# EAGLE design DC24-Darknet_Badge-base (EAGLE 7.5.0)
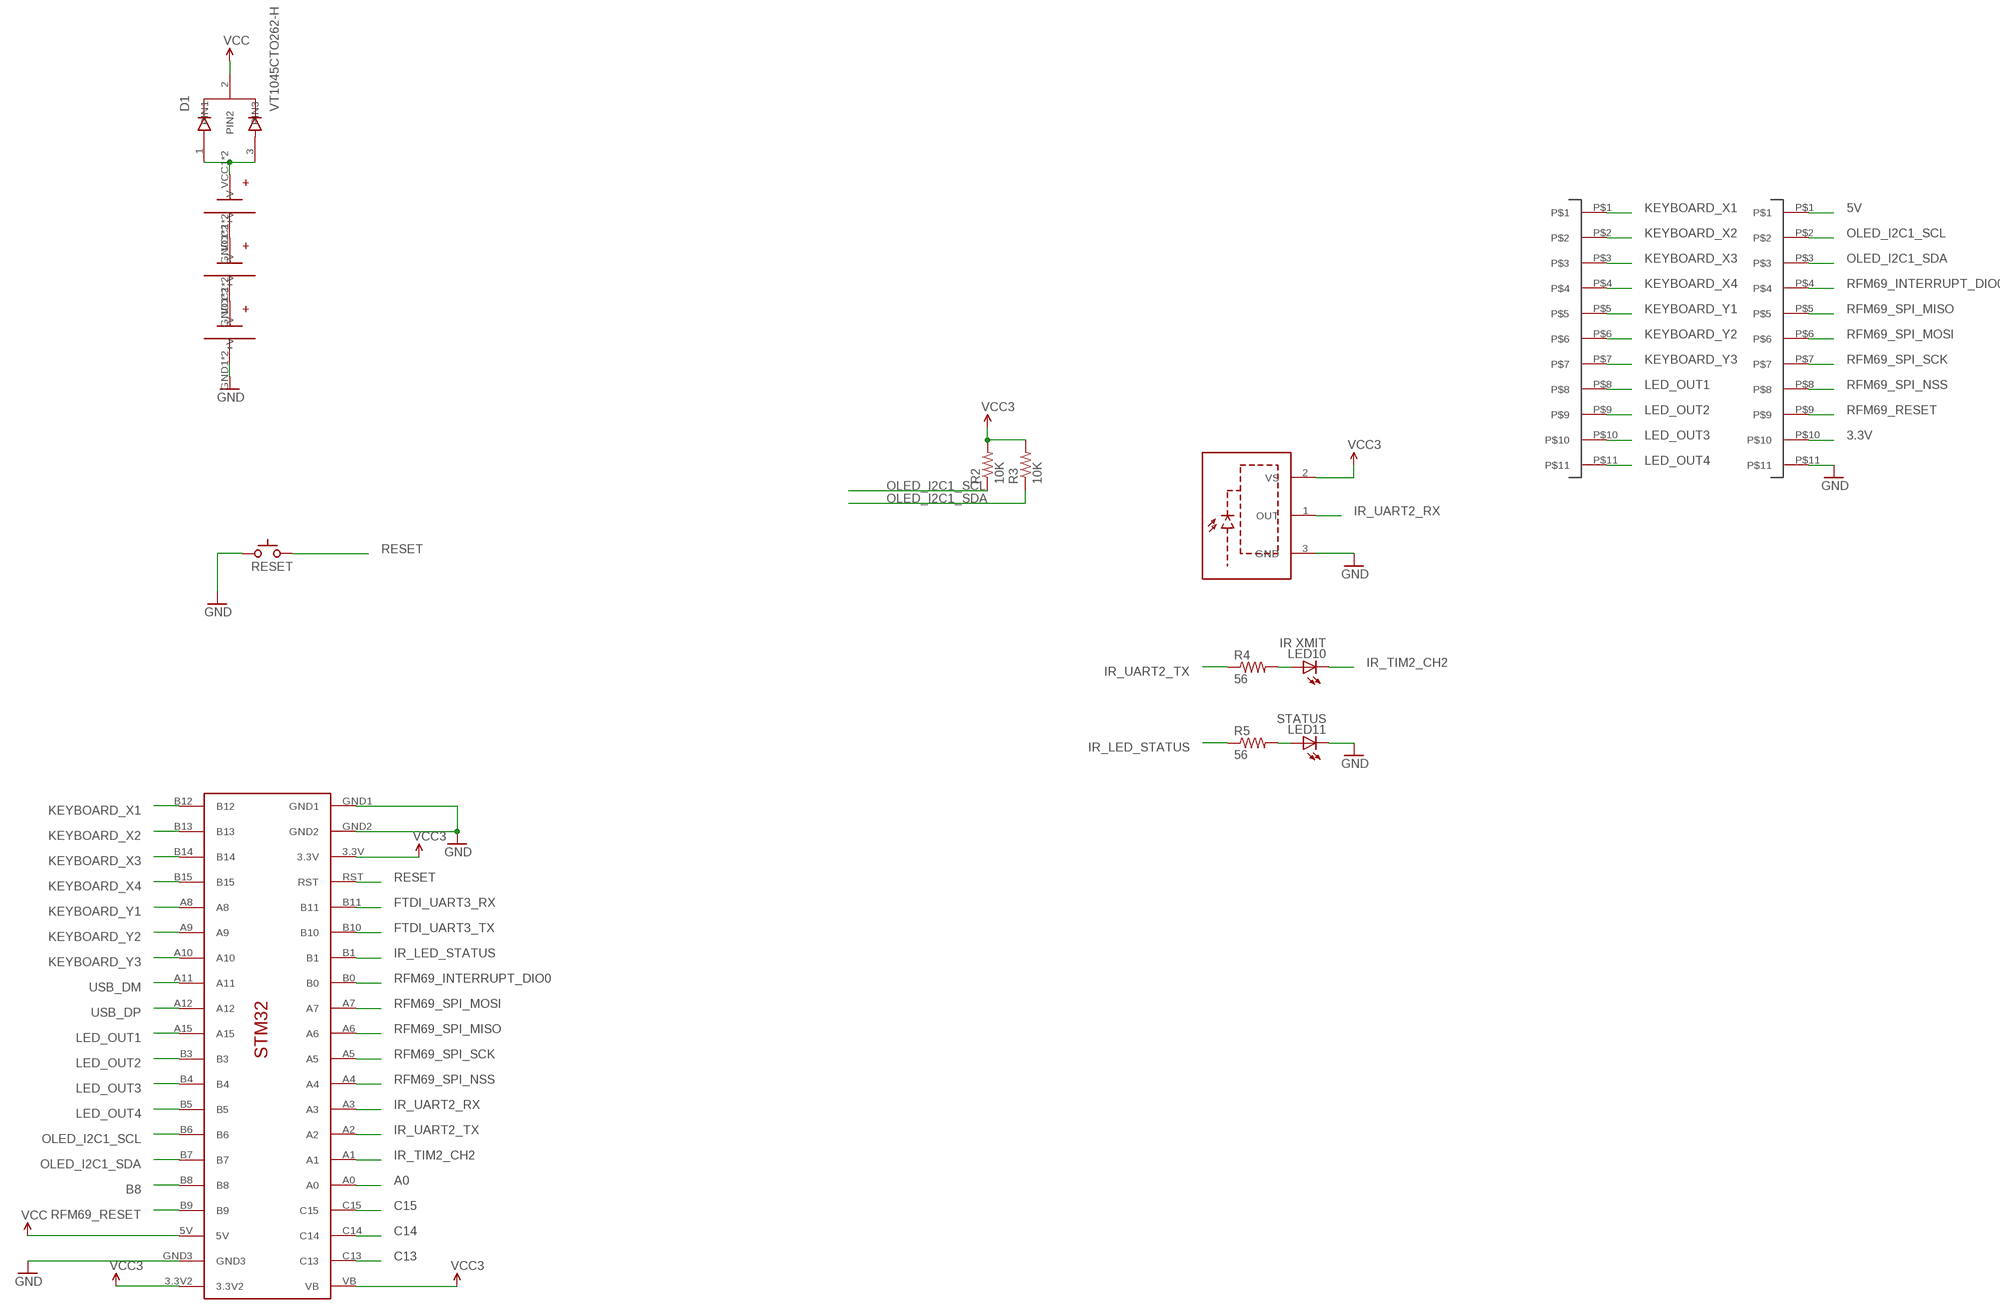
[diagram p0: schematic, sheet 1]

## Parts
D1  VT1045CTO262-H  [TO262-H]
LED10  IR XMIT  LEDLED5MM_EDGE  [LED5MM-EDGE]
LED11  STATUS  LEDLED5MM_EDGE  [LED5MM-EDGE]
R2  10K  RESISTORAXIAL-0.3  [AXIAL-0.3]
R3  10K  RESISTORAXIAL-0.3  [AXIAL-0.3]
R4  56  RESISTORAXIAL-0.3  [AXIAL-0.3]
R5  56  RESISTORAXIAL-0.3  [AXIAL-0.3]
RESET  SWITCH_TACTILETACTILE-2PIN-NARROW  [TACTILE-2PIN-NARROW]
U1  SOP22  [IR-MODULE]
U$3  AAA_BATTERYAAA_BATTERY_CLIP  [AAA_BATTERY_CLIP]
U$4  AAA_BATTERYAAA_BATTERY_CLIP  [AAA_BATTERY_CLIP]
U$5  AAA_BATTERYAAA_BATTERY_CLIP  [AAA_BATTERY_CLIP]
U$14  HEADER_11PIN  [1X11]
U$15  STM32_DEV_BOARDSTM32_DEV_BOARD  [STM32_DEV_BOARD]
U$17  HEADER_11PIN  [1X11]

## Nets
3.3V: R2.P$2 R3.P$2 U1.2(VS) U$15.3.3V U$15.3.3V2 U$15.VB U$17.P$10 ; supply symbol labelled VCC3
5V: D1.2(PIN2) U$15.5V U$17.P$1 ; supply symbol labelled VCC
A0: U$15.A0
B8: U$15.B8
C13: U$15.C13
C14: U$15.C14
C15: U$15.C15
FTDI_UART3_RX: U$15.B11
FTDI_UART3_TX: U$15.B10
GND: LED11.K(C) RESET.P$2(C) U1.3(GND) U$5.GND1(-V) U$5.GND2(-V) U$15.GND1 U$15.GND2 U$15.GND3 U$17.P$11
IR_LED_STATUS: R5.P$1 U$15.B1
IR_TIM2_CH2: LED10.K(C) U$15.A1
IR_UART2_RX: U1.1(OUT) U$15.A3
IR_UART2_TX: R4.P$1 U$15.A2
KEYBOARD_X1: U$14.P$1 U$15.B12
KEYBOARD_X2: U$14.P$2 U$15.B13
KEYBOARD_X3: U$14.P$3 U$15.B14
KEYBOARD_X4: U$14.P$4 U$15.B15
KEYBOARD_Y1: U$14.P$5 U$15.A8
KEYBOARD_Y2: U$14.P$6 U$15.A9
KEYBOARD_Y3: U$14.P$7 U$15.A10
LED_OUT1: U$14.P$8 U$15.A15
LED_OUT2: U$14.P$9 U$15.B3
LED_OUT3: U$14.P$10 U$15.B4
LED_OUT4: U$14.P$11 U$15.B5
N$1: LED10.A R4.P$2
N$2: LED11.A R5.P$2
N$3: D1.1(PIN1) D1.3(PIN3) U$3.VCC1(+V) U$3.VCC2(+V)
N$13: U$3.GND1(-V) U$3.GND2(-V) U$4.VCC1(+V) U$4.VCC2(+V)
N$14: U$4.GND1(-V) U$4.GND2(-V) U$5.VCC1(+V) U$5.VCC2(+V)
OLED_I2C1_SCL: R2.P$1 U$15.B6 U$17.P$2
OLED_I2C1_SDA: R3.P$1 U$15.B7 U$17.P$3
RESET: RESET.P$1(A) U$15.RST
RFM69_INTERRUPT_DIO0: U$15.B0 U$17.P$4
RFM69_RESET: U$15.B9 U$17.P$9
RFM69_SPI_MISO: U$15.A6 U$17.P$5
RFM69_SPI_MOSI: U$15.A7 U$17.P$6
RFM69_SPI_NSS: U$15.A4 U$17.P$8
RFM69_SPI_SCK: U$15.A5 U$17.P$7
USB_DM: U$15.A11
USB_DP: U$15.A12

## Library data of the parts
D1 = SYNShop:VT1045C
LED10 LED11 = SYNShop:LED: LEDs Standard schematic elements and footprints for 5mm, 3mm, 1206, and 0603 sized LEDs. 5mm - Spark Fun Electronics SKU : COM-00529 (and others)
R2-R5 = SYNShop:RESISTOR: Resistor Basic schematic elements and footprints for 0603, 1206, and PTH resistors.
RESET = SYNShop:SWITCH_TACTILE
U1 = SYNShop:SOP22
U$3-U$5 = SYNShop:AAA_BATTERY
U$14 U$17 = SYNShop:HEADER_11PIN
U$15 = SYNShop:STM32_DEV_BOARD

## Board
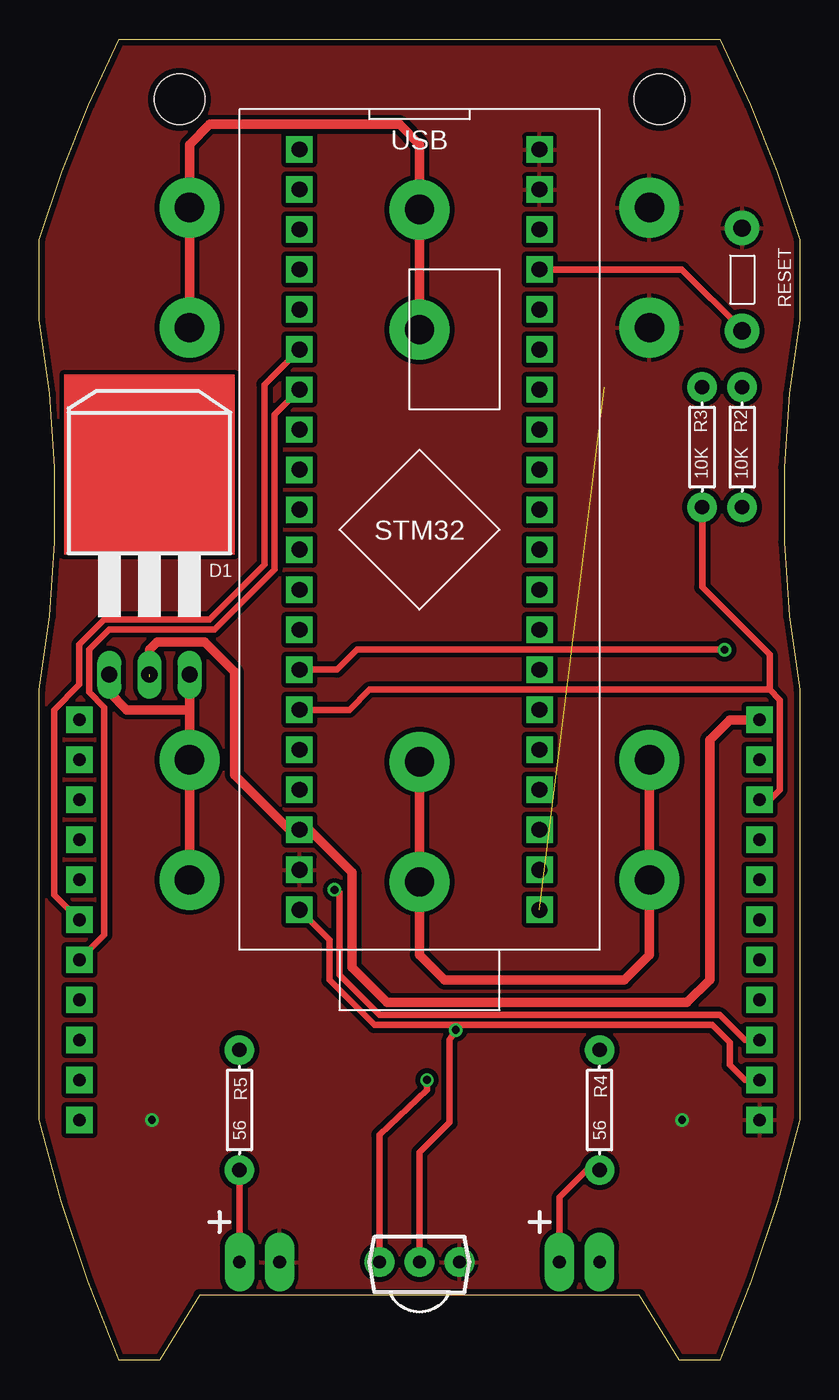
[diagram p1: board, top side]
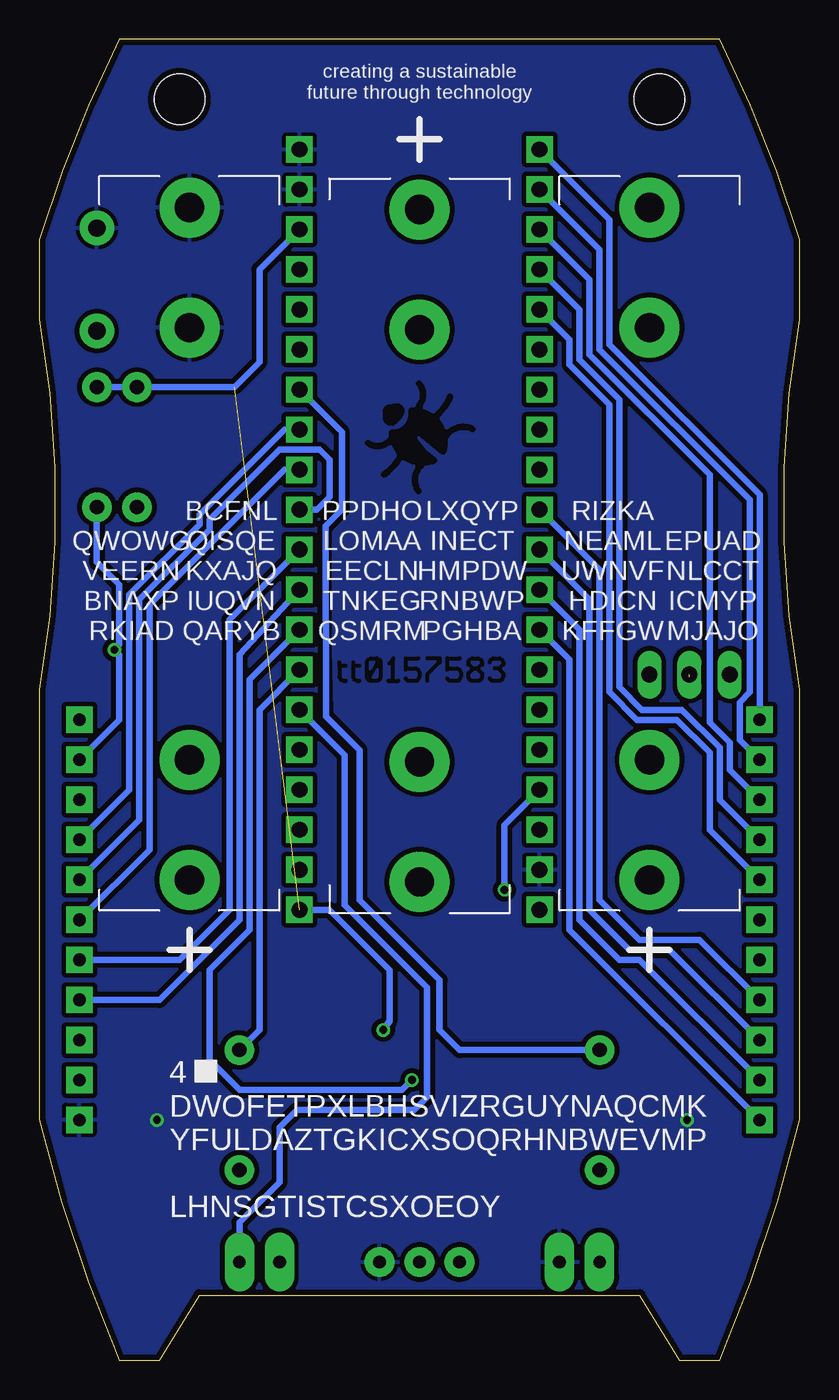
[diagram p2: board, bottom side, seen from below]

Size 48.26 x 83.82 mm. Coordinates in mm from the lower left corner, seen from the top.
Outline: 0,71.12 arc-10 5.08,83.82 43.18,83.82 arc-10 48.26,71.12 48.26,66.04 arc20 48.26,42.55 48.26,15.24 arc-10 43.18,0 40.64,0 38.1,4.13 10.16,4.13 7.62,0 5.08,0 arc-10 0,15.24 0,42.55 arc20 0,66.04 0,71.12
Copper layers (1*16): Top 0.0356mm / dielectric 1.5011mm / Bottom 0.0356mm
Design rules "LaenPCBOrder": minimum track width 6mil, minimum drill 13mil, track to track 6mil, track to pad 6mil, pad to pad 6mil, via to via 6mil, smd to smd 6mil, copper to edge 15mil, drill to drill 6mil, minimum pad ring 7mil, minimum via ring 7mil, stop-mask expansion 4mil, vias tented up to drill 0mil, thermal gap 10mil
Holes 3.2 mm at 8.89,80.01 39.37,80.01
bRestrict: 118 lines

### Footprints (pad centres in the part's own frame; a part is rotated, then mirrored left to right if it is on the bottom)
TO262-H = drill 1.016 long: 1 -2.54,-12.7; 2 0,-12.7; 3 2.54,-12.7
LED5MM-EDGE = drill 0.813 pad 1.88 long: A -1.27,0; K 1.27,0
AXIAL-0.3 = drill 0.9 pad 1.88: P$1 -3.81,0; P$2 3.81,0
TACTILE-2PIN-NARROW = drill 1.1 pad 2.184: P$1 3.264,0; P$2 -3.264,0
IR-MODULE = drill 0.813 pad 1.88: 1 -2.54,0; 2 0,0; 3 2.54,0
AAA_BATTERY_CLIP = drill 1.854 pad 3.81: GND1 35.052,0; GND2 42.672,0; VCC1 0,0; VCC2 7.62,0
1X11 = drill 0.8 pad 1.676 square: P$1 0,0; P$2 0,-2.54; P$3 0,-5.08; P$4 0,-7.62; P$5 0,-10.16; P$6 0,-12.7; P$7 0,-15.24; P$8 0,-17.78; P$9 0,-20.32; P$10 0,-22.86; P$11 0,-25.4
STM32_DEV_BOARD = drill 1 pad 1.676 square: 3.3V 15.24,-5.08; 3.3V2 0,-48.26; 5V 0,-43.18; A0 15.24,-38.1; A1 15.24,-35.56; A2 15.24,-33.02; A3 15.24,-30.48; A4 15.24,-27.94; A5 15.24,-25.4; A6 15.24,-22.86; A7 15.24,-20.32; A8 0,-10.16; A9 0,-12.7; A10 0,-15.24; A11 0,-17.78; A12 0,-20.32; A15 0,-22.86; B0 15.24,-17.78; B1 15.24,-15.24; B3 0,-25.4; B4 0,-27.94; B5 0,-30.48; B6 0,-33.02; B7 0,-35.56; B8 0,-38.1; B9 0,-40.64; B10 15.24,-12.7; B11 15.24,-10.16; B12 0,0; B13 0,-2.54; B14 0,-5.08; B15 0,-7.62; C13 15.24,-45.72; C14 15.24,-43.18; C15 15.24,-40.64; GND1 15.24,0; GND2 15.24,-2.54; GND3 0,-45.72; RST 15.24,-7.62; VB 15.24,-48.26

### Placement (x,y rotation side)
D1  6.99,56.2 0 top
LED10  34.29,6.22 0 top
LED11  13.97,6.22 0 top
R2  44.61,57.94 90 top
R3  42.07,57.94 90 top
R4  35.56,15.87 270 top
R5  12.7,15.87 270 top
RESET  44.61,68.58 270 top
U1  24.13,6.22 0 top
U$3  9.52,30.48 90 bottom
U$4  24.13,73.03 270 bottom
U$5  38.73,30.48 90 bottom
U$14  2.54,40.64 0 top
U$15  16.51,76.84 0 top
U$17  45.72,40.64 0 top

### Tracks (layer width: path | path; a pad name or v marks a point on that pad's centre or on a via)
3.3V  (via drill 0.5)  (1 unrouted)
  Top 0.406: U$15.3.3V2 18.41,26.67 18.41,24.13 21.27,21.27 26.04,21.27 | 26.04,21.27 26.43,21.11 v26.43,20.95 26.04,20.32 26.04,15.08 24.13,13.18 U1.2 | 26.04,21.27 42.7,21.27 43.81,20.16 43.81,18.73 44.77,17.78 U$17.P$10
  Bottom 0.406: U$15.VB 29.84,28.58 26.04,24.77 26.04,21.51 v26.43,20.95 | U$15.3.3V 34.29,69.22 34.29,63.34 35.88,61.75 R3.P$2 R2.P$2
5V  (1 unrouted)
  Top 0.61: U$17.P$1 43.81,40.64 42.55,39.37 42.55,24.13 41.12,22.7 22.07,22.7 19.84,24.92 19.84,30.96 17.14,33.66 U$15.5V 15.88,33.66 12.38,37.15 12.38,43.66 10.48,45.56 7.46,45.56 6.99,45.09 6.99,43.34
GND  (via drill 0.5)
  other vias: 40.8,15.24 7.14,15.24
  pour Top (isolate 0.305): 0.32,42.55 0.32,15.24 1.91,9.21 5.08,0.32 7.62,0.32 10.16,4.45 38.1,4.45 40.64,0.32 43.18,0.32 46.36,9.21 47.94,15.24 47.94,42.55 46.99,50.8 46.99,58.1 47.94,66.04 47.94,71.12 45.72,77.79 43.18,83.5 5.4,83.5 2.54,77.79 0.32,71.12 0.32,66.04 1.27,57.47 1.27,51.44
  pour Bottom (isolate 0.305): 2.54,77.47 0.32,71.12 0.32,66.36 0.95,59.37 0.95,53.66 0.63,47.94 0,42.86 0,15.56 2.22,8.26 5.08,0.32 7.62,0.32 10.16,4.45 38.1,4.45 40.64,0.32 43.18,0.32 46.36,9.21 48.26,15.56 48.26,42.86 47.31,49.53 47.31,57.79 48.26,66.36 47.94,71.12 45.72,77.79 43.18,83.5 5.08,83.5
  pour Bottom (rank 2): 18.49,62.98 29.71,62.98 29.71,61.1 29.51,60.9 29.51,60.7 28.22,59.41 28.22,53.46 28.12,53.36 28.52,53.66 29.61,52.57 29.61,45.12 29.51,41.16 18.3,41.65
IR_LED_STATUS
  Bottom 0.406: R5.P$1 21.59,19.69 22.86,20.95 22.86,24.13 27.94,29.21 27.94,38.73 30.06,40.86 30.1,52.92 29.05,53.98 29.05,58.9 U$15.B1
IR_TIM2_CH2
  Bottom 0.406: U$15.A1 28.89,38.42 28.89,28.89 23.65,23.65 23.65,16.67 24.45,15.87 31.91,15.87 33.02,14.76 33.02,11.27 35.56,8.73 LED10.K
IR_UART2_RX  (via drill 0.5)
  Top 0.406: v24.61,17.78 24.61,17.15 21.59,14.29 U1.1
  Bottom 0.406: U$15.A3 34.93,43.18 34.93,27.3 37.47,24.77 37.47,19.05 35.56,17.15 25.24,17.15 v24.61,17.78
IR_UART2_TX
  Bottom 0.406: R4.P$1 34.29,20.95 34.29,41.27 U$15.A2
KEYBOARD_X1
  Bottom 0.406: U$15.B12 12.07,72.39 12.07,64.45 2.54,54.93 U$14.P$1
KEYBOARD_X2
  Bottom 0.406: U$15.B13 12.7,70.48 12.7,64.14 3.17,54.61 3.17,42.39 3.81,41.75 3.81,39.37 U$14.P$2
KEYBOARD_X3
  Bottom 0.406: U$15.B14 13.34,68.58 13.34,63.82 5.72,56.2 5.72,40.48 4.45,39.21 4.45,37.47 U$14.P$3
KEYBOARD_X4
  Bottom 0.406: U$15.B15 13.97,66.67 13.97,63.5 11.43,60.96 11.43,42.7 10,41.27 7.46,41.27 5.08,38.89 5.08,35.56 U$14.P$4
KEYBOARD_Y1
  Bottom 0.406: U$15.A8 14.61,64.77 14.61,63.18 12.07,60.64 12.07,42.39 10.32,40.64 7.78,40.64 5.72,38.58 5.72,33.66 U$14.P$5
KEYBOARD_Y2
  Top 0.406: U$15.A9 14.29,61.91 14.29,50.48 10.8,46.99 4.13,46.99 2.54,45.4 2.54,42.86 0.95,41.27 0.95,29.53 U$14.P$6
KEYBOARD_Y3
  Top 0.406: U$15.A10 14.92,60.01 14.92,50.16 11.11,46.36 4.45,46.36 3.17,45.09 3.17,42.39 4.13,41.43 4.13,26.99 U$14.P$7
LED_OUT1
  Bottom 0.406: U$15.A15 12.7,50.16 12.7,29.21 10.16,26.67 6.35,26.67 U$14.P$8
LED_OUT2
  Bottom 0.406: U$15.B3 13.34,48.26 13.34,28.58 10.8,26.03 8.25,26.03 U$14.P$9
LED_OUT3
  Bottom 0.406: U$15.B4 13.97,46.36 13.97,27.94 11.43,25.4 10.16,25.4 U$14.P$10
LED_OUT4
  Bottom 0.406: U$15.B5 14.61,44.45 14.61,27.3 U$14.P$11
N$1
  Top 0.406: R4.P$2 34.77,12.06 33.02,10.32 LED10.A
N$2
  Top 0.406: R5.P$2 LED11.A
N$3
  Top 0.61: 9.52,41.27 U$3.VCC2 U$3.VCC1 | D1.3 9.52,41.27 | 9.52,41.27 5.56,41.27 4.45,42.39 D1.1
N$13
  Top 0.61: U$3.GND1 U$3.GND2 9.52,77.15 10.8,78.42 22.86,78.42 24.13,77.15 U$4.VCC1 U$4.VCC2
N$14
  Top 0.61: U$4.GND1 U$4.GND2 24.13,25.72 25.72,24.13 37.15,24.13 38.73,25.72 U$5.VCC1 U$5.VCC2
OLED_I2C1_SCL  (via drill 0.5)
  Top 0.406: v43.5,45.09 20.16,45.09 18.89,43.82 U$15.B6
  Bottom 0.406: U$17.P$2 43.18,40.64 43.18,44.77 v43.5,45.09 43.18,45.4 43.18,49.21 44.61,50.64 R2.P$1
OLED_I2C1_SDA
  Top 0.406: U$17.P$3 46.36,35.56 46.99,36.2 46.99,41.91 46.36,42.55 | 46.36,42.55 20.96,42.55 19.69,41.27 U$15.B7 | R3.P$1 42.07,49.05 46.36,44.77 46.36,42.55
RESET
  Top 0.406: RESET.P$1 44.61,65.41 40.8,69.22 U$15.RST
RFM69_INTERRUPT_DIO0
  Bottom 0.406: U$15.B0 32.7,59.06 38.1,53.66 38.1,53.02 42.55,48.58 42.55,36.2 U$17.P$4
RFM69_RESET  (via drill 0.5)
  Top 0.406: U$17.P$9 44.77,20.32 43.18,21.91 21.59,21.91 19.05,24.45 19.05,29.69 v18.73,29.84
  Bottom 0.406: v18.73,29.84 18.73,33.97 U$15.B9
RFM69_SPI_MISO
  Bottom 0.406: U$17.P$5 41.91,34.29 41.91,48.26 37.47,52.7 37.47,53.34 33.02,57.79 30.48,57.79 29.84,57.15 29.84,54.77 30.64,53.98 U$15.A6
RFM69_SPI_MOSI
  Bottom 0.406: U$17.P$6 41.27,32.39 41.27,47.94 32.7,56.52 U$15.A7
RFM69_SPI_NSS
  Bottom 0.406: U$15.A4 35.56,44.77 35.56,27.94 40.64,22.86 U$17.P$8
RFM69_SPI_SCK
  Bottom 0.406: U$15.A5 36.2,46.99 36.2,28.58 39.37,25.4 U$17.P$7

### Text on the board
_tsilk: VCC | B12 | B13 | SCL | B6 | B7 | B14 | SDA | B15 | B0 | A6 | A8 | MOSI | A9 | A7 | MISO | A5 | A10 | SCK | PROG | A15 | A4 | NSS | B9 | B3 | 3.3V | B4 | GND | B5 | https://dcdark.net/ | IR RECV | U1
_bsilk: creating a sustainable / future through technology | EPUAD / NLCCT / ICMYP / MJAJO | RIZKA / NEAML / UWNVF / HDICN / KFFGW | LXQYP / INECT / HMPDW / RNBWP / PGHBA | PPDHO / LOMAA / EECLN / TNKEG / QSMRM | BCFNL / QISQE / KXAJQ / IUQVN / QARYB | QWOWG / VEERN / BNAXP / RKIAD | 4 / DWOFETPXLBHSVIZRGUYNAQCMK / YFULDAZTGKICXSOQRHNBWEVMP / / LHNSGTISTCSXOEOY